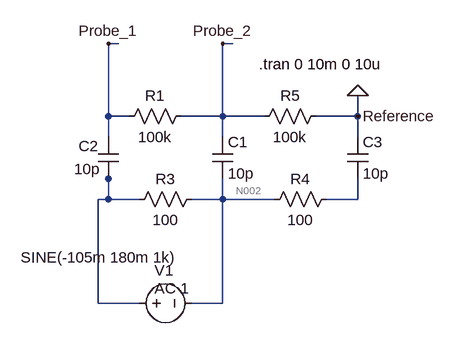
[diagram p0: schematic SkinFilteringEffect.asc]
SkinFilteringEffect.asc, the LTspice schematic file:
Version 4
SHEET 1 1688 680
WIRE 144 -16 128 -16
WIRE 320 -16 304 -16
WIRE 128 96 128 -16
WIRE 160 96 128 96
WIRE 304 96 304 -16
WIRE 304 96 240 96
WIRE 368 96 304 96
WIRE 512 96 512 64
WIRE 512 96 448 96
WIRE 128 128 128 96
WIRE 304 128 304 96
WIRE 512 128 512 96
WIRE 128 192 128 176
WIRE 128 224 128 192
WIRE 128 224 112 224
WIRE 176 224 128 224
WIRE 304 224 304 192
WIRE 304 224 256 224
WIRE 384 224 304 224
WIRE 512 224 512 192
WIRE 512 224 464 224
WIRE 112 384 112 224
WIRE 176 384 112 384
WIRE 304 384 304 224
WIRE 304 384 256 384
FLAG 512 64 0
FLAG 512 96 Reference
FLAG 128 -16 Probe_1
FLAG 304 -16 Probe_2
SYMBOL res 256 80 R90
WINDOW 0 0 56 VBottom 2
WINDOW 3 32 56 VTop 2
SYMATTR InstName R1
SYMATTR Value 100k
SYMBOL cap 288 128 R0
SYMATTR InstName C1
SYMATTR Value 10p
SYMBOL voltage 160 384 R270
WINDOW 3 71 -167 VRight 2
WINDOW 123 23 39 VRight 2
WINDOW 39 0 0 Left 0
WINDOW 0 51 39 VRight 2
SYMATTR Value SINE(-105m 180m 1k)
SYMATTR Value2 AC 1
SYMATTR InstName V1
SYMBOL cap 112 128 R0
WINDOW 0 -30 14 Left 2
WINDOW 3 -37 49 Left 2
SYMATTR InstName C2
SYMATTR Value 10p
SYMBOL res 272 208 R90
WINDOW 0 0 56 VBottom 2
WINDOW 3 32 56 VTop 2
SYMATTR InstName R3
SYMATTR Value 100
SYMBOL res 480 208 R90
WINDOW 0 0 56 VBottom 2
WINDOW 3 32 56 VTop 2
SYMATTR InstName R4
SYMATTR Value 100
SYMBOL cap 496 128 R0
SYMATTR InstName C3
SYMATTR Value 10p
SYMBOL res 464 80 R90
WINDOW 0 0 56 VBottom 2
WINDOW 3 32 56 VTop 2
SYMATTR InstName R5
SYMATTR Value 100k
TEXT 360 16 Left 2 !.tran 0 10m 0 10u

The netlist it stands for:
* SkinFilteringEffect.asc
R1 Probe_2 Probe_1 100k
C1 Probe_2 N002 10p
V1 N001 N002 SINE(-105m 180m 1k) AC 1
C2 Probe_1 N001 10p
R3 N002 N001 100
R4 N003 N002 100
C3 0 N003 10p
R5 0 Probe_2 100k
.tran 0 10m 0 10u
.backanno
.end

* Results of the author's LTspice run, read from the files saved beside the schematic
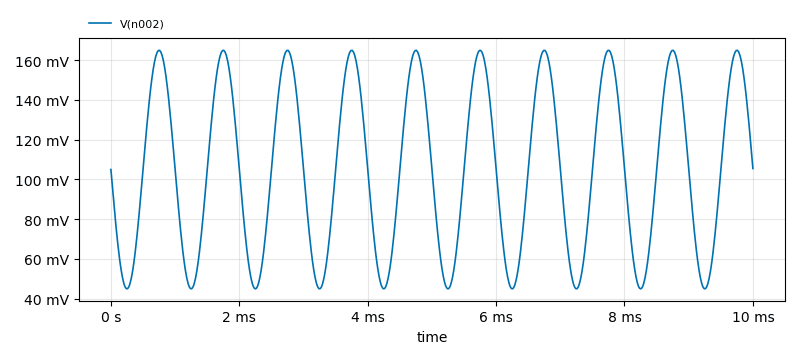
[diagram p1: Transient Analysis of SkinFilteringEffect.asc, plotted from the saved traces]
* Transient Analysis, 1 run:
*   V(n002): min 45 mV, max 164.9 mV, average 105 mV, rms 113.2 mV, last 105.5 mV